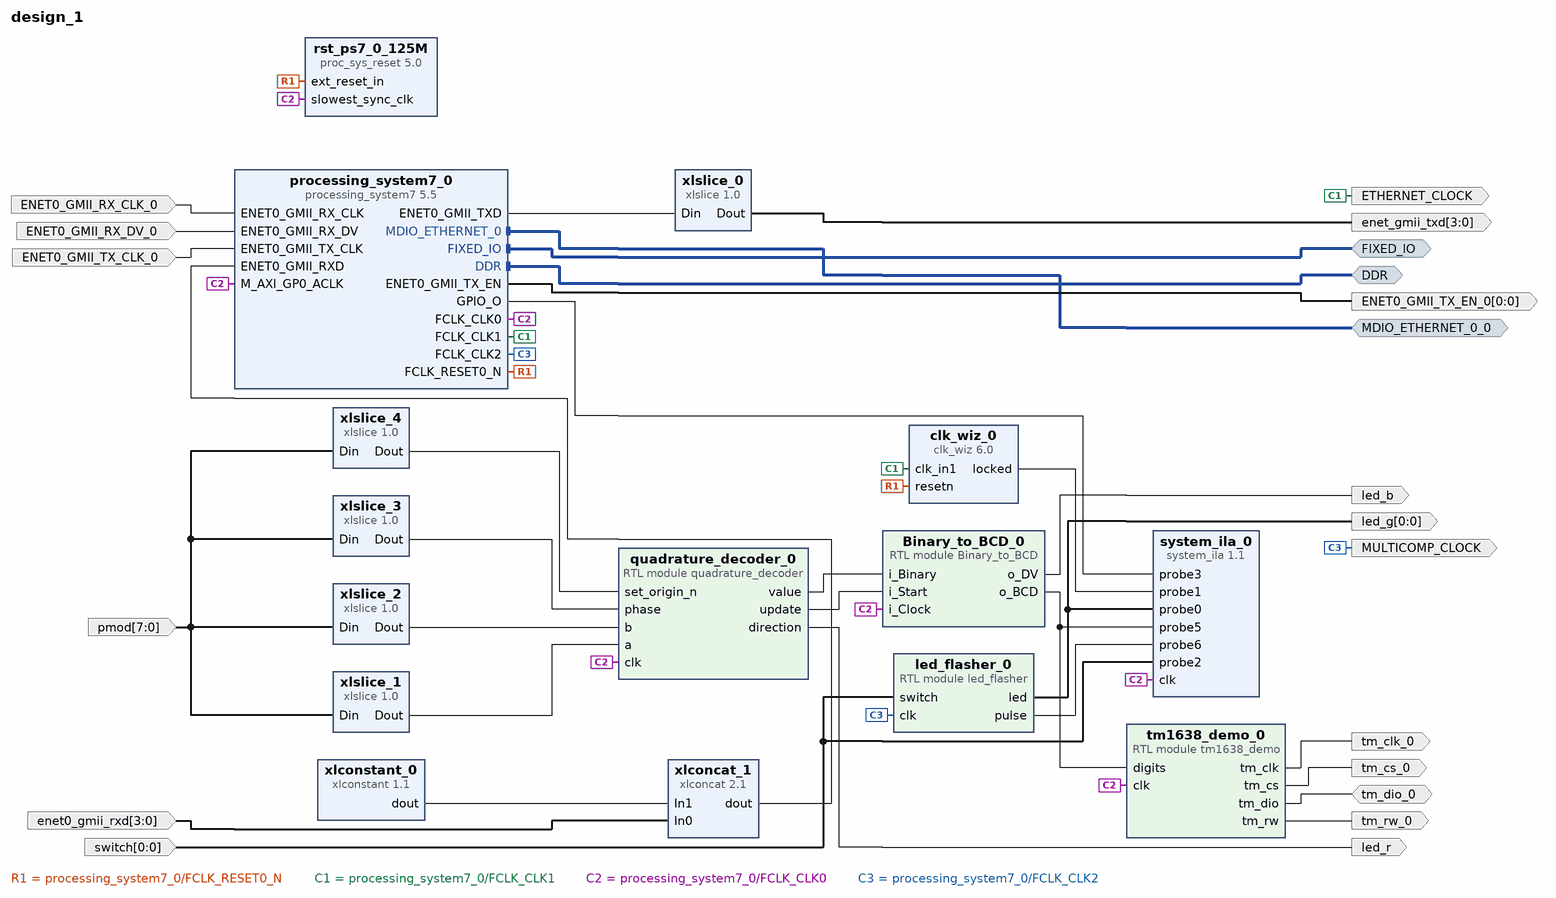
[diagram p0: block diagram of the top level]
# Vivado block design design_1, xc7z010clg400-1, Vivado 2020.2.1
create_bd_design design_1

create_bd_intf_port -mode Master -vlnv xilinx.com:interface:ddrx_rtl:1.0 DDR
create_bd_intf_port -mode Master -vlnv xilinx.com:display_processing_system7:fixedio_rtl:1.0 FIXED_IO
create_bd_intf_port -mode Master -vlnv xilinx.com:interface:mdio_rtl:1.0 MDIO_ETHERNET_0_0
create_bd_port -dir I -from 3 -to 0 enet0_gmii_rxd
create_bd_port -dir O -from 3 -to 0 enet_gmii_txd
create_bd_port -dir O -from 0 -to 0 ENET0_GMII_TX_EN_0
create_bd_port -dir I -type clk ENET0_GMII_RX_CLK_0
create_bd_port -dir I ENET0_GMII_RX_DV_0
create_bd_port -dir I -type clk ENET0_GMII_TX_CLK_0
create_bd_port -dir O -from 0 -to 0 led_g
create_bd_port -dir I -from 0 -to 0 switch
create_bd_port -dir O -type clk ETHERNET_CLOCK
set_property -dict {CONFIG.FREQ_HZ 25000000} [get_bd_ports ETHERNET_CLOCK]
create_bd_port -dir O -type clk MULTICOMP_CLOCK
create_bd_port -dir O tm_cs_0
create_bd_port -dir O -type clk tm_clk_0
create_bd_port -dir IO tm_dio_0
create_bd_port -dir O tm_rw_0
create_bd_port -dir I -from 7 -to 0 pmod
create_bd_port -dir O led_r
create_bd_port -dir O led_b

create_bd_cell -type ip -vlnv xilinx.com:ip:processing_system7:5.5 processing_system7_0
set_property -dict [list \
  CONFIG.PCW_ENET0_ENET0_IO EMIO \
  CONFIG.PCW_ENET0_GRP_MDIO_ENABLE 1 \
  CONFIG.PCW_ENET0_GRP_MDIO_IO EMIO \
  CONFIG.PCW_ENET0_PERIPHERAL_ENABLE 1 \
  CONFIG.PCW_ENET0_PERIPHERAL_FREQMHZ {100 Mbps} \
  CONFIG.PCW_ENET_RESET_ENABLE 0 \
  CONFIG.PCW_EN_CLK1_PORT 1 \
  CONFIG.PCW_EN_CLK2_PORT 1 \
  CONFIG.PCW_FCLK_CLK1_BUF TRUE \
  CONFIG.PCW_FCLK_CLK2_BUF TRUE \
  CONFIG.PCW_FPGA0_PERIPHERAL_FREQMHZ 125 \
  CONFIG.PCW_FPGA1_PERIPHERAL_FREQMHZ 25 \
  CONFIG.PCW_FPGA2_PERIPHERAL_FREQMHZ 33.3 \
  CONFIG.PCW_FPGA3_PERIPHERAL_FREQMHZ 25 \
  CONFIG.PCW_FPGA_FCLK1_ENABLE 1 \
  CONFIG.PCW_FPGA_FCLK2_ENABLE 1 \
  CONFIG.PCW_GPIO_EMIO_GPIO_ENABLE 1 \
  CONFIG.PCW_GPIO_EMIO_GPIO_IO 8 \
  CONFIG.PCW_GPIO_EMIO_GPIO_WIDTH 8 \
  CONFIG.PCW_GPIO_MIO_GPIO_ENABLE 1 \
  CONFIG.PCW_GPIO_MIO_GPIO_IO MIO \
  CONFIG.PCW_I2C0_GRP_INT_ENABLE 0 \
  CONFIG.PCW_I2C0_I2C0_IO {MIO 26 .. 27} \
  CONFIG.PCW_I2C0_PERIPHERAL_ENABLE 1 \
  CONFIG.PCW_I2C_PERIPHERAL_FREQMHZ 111.111115 \
  CONFIG.PCW_I2C_RESET_ENABLE 0 \
  CONFIG.PCW_NAND_NAND_IO {MIO 0 2.. 14} \
  CONFIG.PCW_NAND_PERIPHERAL_ENABLE 1 \
  CONFIG.PCW_SD0_GRP_CD_ENABLE 0 \
  CONFIG.PCW_SD0_GRP_WP_ENABLE 0 \
  CONFIG.PCW_SD0_PERIPHERAL_ENABLE 1 \
  CONFIG.PCW_SD0_SD0_IO {MIO 40 .. 45} \
  CONFIG.PCW_SDIO_PERIPHERAL_FREQMHZ 100 \
  CONFIG.PCW_TTC0_PERIPHERAL_ENABLE 1 \
  CONFIG.PCW_TTC0_TTC0_IO EMIO \
  CONFIG.PCW_UART1_PERIPHERAL_ENABLE 1 \
  CONFIG.PCW_UART1_UART1_IO {MIO 24 .. 25} \
  CONFIG.PCW_UART_PERIPHERAL_FREQMHZ 100 \
  CONFIG.PCW_UIPARAM_DDR_BUS_WIDTH {16 Bit} \
  CONFIG.PCW_UIPARAM_DDR_PARTNO {MT41K128M16 JT-125} \
  CONFIG.PCW_USB_RESET_ENABLE 0 \
] [get_bd_cells processing_system7_0]
# 212 more settings of processing_system7_0 are not shown: defaults, MIO pin electricals, DDR timing, and values the tool derives
create_bd_cell -type ip -vlnv xilinx.com:ip:xlconcat:2.1 xlconcat_1
set_property -dict {CONFIG.IN0_WIDTH 4 CONFIG.IN1_WIDTH 4 CONFIG.NUM_PORTS 2 CONFIG.dout_width 8} [get_bd_cells xlconcat_1]
create_bd_cell -type ip -vlnv xilinx.com:ip:xlconstant:1.1 xlconstant_0
set_property -dict {CONFIG.CONST_WIDTH 4} [get_bd_cells xlconstant_0]
create_bd_cell -type ip -vlnv xilinx.com:ip:xlslice:1.0 xlslice_0
set_property -dict {CONFIG.DIN_FROM 3 CONFIG.DIN_WIDTH 8 CONFIG.DOUT_WIDTH 3} [get_bd_cells xlslice_0]
create_bd_cell -type ip -vlnv xilinx.com:ip:system_ila:1.1 system_ila_0
set_property -dict [list \
  CONFIG.ALL_PROBE_SAME_MU false \
  CONFIG.C_MON_TYPE NATIVE \
  CONFIG.C_NUM_OF_PROBES 7 \
  CONFIG.C_PROBE0_WIDTH 1 \
  CONFIG.C_PROBE2_WIDTH 1 \
  CONFIG.C_PROBE3_MU_CNT 1 \
  CONFIG.C_PROBE3_WIDTH 8 \
  CONFIG.C_PROBE4_WIDTH 32 \
  CONFIG.C_PROBE5_WIDTH 32 \
  CONFIG.C_PROBE_WIDTH_PROPAGATION MANUAL \
] [get_bd_cells system_ila_0]
create_bd_cell -type ip -vlnv xilinx.com:ip:clk_wiz:6.0 clk_wiz_0
set_property -dict [list \
  CONFIG.CLKOUT1_DRIVES BUFG \
  CONFIG.CLKOUT1_JITTER 401.466 \
  CONFIG.CLKOUT1_PHASE_ERROR 245.713 \
  CONFIG.CLKOUT1_REQUESTED_OUT_FREQ 25 \
  CONFIG.CLKOUT2_DRIVES BUFG \
  CONFIG.CLKOUT3_DRIVES BUFG \
  CONFIG.CLKOUT4_DRIVES BUFG \
  CONFIG.CLKOUT5_DRIVES BUFG \
  CONFIG.CLKOUT6_DRIVES BUFG \
  CONFIG.CLKOUT7_DRIVES BUFG \
  CONFIG.MMCM_CLKFBOUT_MULT_F 36.500 \
  CONFIG.MMCM_CLKOUT0_DIVIDE_F 36.500 \
  CONFIG.RESET_PORT resetn \
  CONFIG.RESET_TYPE ACTIVE_LOW \
  CONFIG.SECONDARY_SOURCE Single_ended_clock_capable_pin \
  CONFIG.USE_PHASE_ALIGNMENT false \
] [get_bd_cells clk_wiz_0]
create_bd_cell -type ip -vlnv xilinx.com:ip:proc_sys_reset:5.0 rst_ps7_0_125M
create_bd_cell -type ip -vlnv xilinx.com:ip:xlslice:1.0 xlslice_1
set_property -dict {CONFIG.DIN_FROM 0 CONFIG.DIN_TO 0 CONFIG.DIN_WIDTH 8 CONFIG.DOUT_WIDTH 1} [get_bd_cells xlslice_1]
create_bd_cell -type ip -vlnv xilinx.com:ip:xlslice:1.0 xlslice_2
set_property -dict {CONFIG.DIN_FROM 1 CONFIG.DIN_TO 1 CONFIG.DIN_WIDTH 8 CONFIG.DOUT_WIDTH 1} [get_bd_cells xlslice_2]
create_bd_cell -type ip -vlnv xilinx.com:ip:xlslice:1.0 xlslice_3
set_property -dict {CONFIG.DIN_FROM 3 CONFIG.DIN_TO 3 CONFIG.DIN_WIDTH 8 CONFIG.DOUT_WIDTH 1} [get_bd_cells xlslice_3]
create_bd_cell -type ip -vlnv xilinx.com:ip:xlslice:1.0 xlslice_4
set_property -dict {CONFIG.DIN_FROM 2 CONFIG.DIN_TO 2 CONFIG.DIN_WIDTH 8 CONFIG.DOUT_WIDTH 1} [get_bd_cells xlslice_4]
create_bd_cell -type module -reference led_flasher led_flasher_0
create_bd_cell -type module -reference tm1638_demo tm1638_demo_0
create_bd_cell -type module -reference quadrature_decoder quadrature_decoder_0
create_bd_cell -type module -reference Binary_to_BCD Binary_to_BCD_0

# ---- connections ----

connect_bd_intf_net [get_bd_intf_ports MDIO_ETHERNET_0_0] [get_bd_intf_pins processing_system7_0/MDIO_ETHERNET_0]
connect_bd_intf_net [get_bd_intf_ports FIXED_IO] [get_bd_intf_pins processing_system7_0/FIXED_IO]
connect_bd_intf_net [get_bd_intf_ports DDR] [get_bd_intf_pins processing_system7_0/DDR]
connect_bd_net [get_bd_pins xlconcat_1/dout] [get_bd_pins processing_system7_0/ENET0_GMII_RXD]
connect_bd_net -net In0_0_1 [get_bd_ports enet0_gmii_rxd] [get_bd_pins xlconcat_1/In0]
connect_bd_net [get_bd_pins processing_system7_0/ENET0_GMII_TX_EN] [get_bd_ports ENET0_GMII_TX_EN_0]
connect_bd_net -net ENET0_GMII_RX_CLK_0_1 [get_bd_ports ENET0_GMII_RX_CLK_0] [get_bd_pins processing_system7_0/ENET0_GMII_RX_CLK]
connect_bd_net -net ENET0_GMII_RX_DV_0_1 [get_bd_ports ENET0_GMII_RX_DV_0] [get_bd_pins processing_system7_0/ENET0_GMII_RX_DV]
connect_bd_net -net ENET0_GMII_TX_CLK_0_1 [get_bd_ports ENET0_GMII_TX_CLK_0] [get_bd_pins processing_system7_0/ENET0_GMII_TX_CLK]
connect_bd_net [get_bd_pins xlconstant_0/dout] [get_bd_pins xlconcat_1/In1]
connect_bd_net [get_bd_pins processing_system7_0/ENET0_GMII_TXD] [get_bd_pins xlslice_0/Din]
connect_bd_net [get_bd_pins xlslice_0/Dout] [get_bd_ports enet_gmii_txd]
connect_bd_net [get_bd_pins processing_system7_0/FCLK_RESET0_N] [get_bd_pins clk_wiz_0/resetn] [get_bd_pins rst_ps7_0_125M/ext_reset_in]
connect_bd_net [get_bd_pins clk_wiz_0/locked] [get_bd_pins system_ila_0/probe1]
connect_bd_net [get_bd_pins processing_system7_0/FCLK_CLK1] [get_bd_ports ETHERNET_CLOCK] [get_bd_pins clk_wiz_0/clk_in1]
connect_bd_net -net led_flasher_0_led_g [get_bd_pins led_flasher_0/led] [get_bd_pins system_ila_0/probe0] [get_bd_ports led_g]
connect_bd_net [get_bd_pins processing_system7_0/FCLK_CLK0] \
  [get_bd_pins processing_system7_0/M_AXI_GP0_ACLK] [get_bd_pins system_ila_0/clk] \
  [get_bd_pins rst_ps7_0_125M/slowest_sync_clk] [get_bd_pins tm1638_demo_0/clk] [get_bd_pins quadrature_decoder_0/clk] \
  [get_bd_pins Binary_to_BCD_0/i_Clock]
connect_bd_net [get_bd_pins processing_system7_0/GPIO_O] [get_bd_pins system_ila_0/probe3]
connect_bd_net [get_bd_pins processing_system7_0/FCLK_CLK2] [get_bd_ports MULTICOMP_CLOCK] [get_bd_pins led_flasher_0/clk]
connect_bd_net [get_bd_pins tm1638_demo_0/tm_cs] [get_bd_ports tm_cs_0]
connect_bd_net [get_bd_pins tm1638_demo_0/tm_clk] [get_bd_ports tm_clk_0]
connect_bd_net [get_bd_ports switch] [get_bd_pins system_ila_0/probe2] [get_bd_pins led_flasher_0/switch]
connect_bd_net [get_bd_ports tm_dio_0] [get_bd_pins tm1638_demo_0/tm_dio]
connect_bd_net [get_bd_pins tm1638_demo_0/tm_rw] [get_bd_ports tm_rw_0]
connect_bd_net [get_bd_ports pmod] [get_bd_pins xlslice_1/Din] [get_bd_pins xlslice_2/Din] [get_bd_pins xlslice_3/Din] [get_bd_pins xlslice_4/Din]
connect_bd_net [get_bd_pins xlslice_4/Dout] [get_bd_pins quadrature_decoder_0/set_origin_n]
connect_bd_net [get_bd_pins Binary_to_BCD_0/o_BCD] [get_bd_pins system_ila_0/probe5] [get_bd_pins tm1638_demo_0/digits]
connect_bd_net [get_bd_pins led_flasher_0/pulse] [get_bd_pins system_ila_0/probe6]
connect_bd_net [get_bd_pins xlslice_1/Dout] [get_bd_pins quadrature_decoder_0/a]
connect_bd_net [get_bd_pins xlslice_2/Dout] [get_bd_pins quadrature_decoder_0/b]
connect_bd_net -net quadrature_decoder_0_position [get_bd_pins quadrature_decoder_0/value] [get_bd_pins Binary_to_BCD_0/i_Binary]
connect_bd_net [get_bd_pins quadrature_decoder_0/direction] [get_bd_ports led_r]
connect_bd_net [get_bd_pins quadrature_decoder_0/update] [get_bd_pins Binary_to_BCD_0/i_Start]
connect_bd_net [get_bd_pins xlslice_3/Dout] [get_bd_pins quadrature_decoder_0/phase]
connect_bd_net [get_bd_pins Binary_to_BCD_0/o_DV] [get_bd_ports led_b]

validate_bd_design
save_bd_design
